# EAGLE design Black-CP2102-Zigbee-SMD-V001-not-produced (EAGLE 9.3.0)
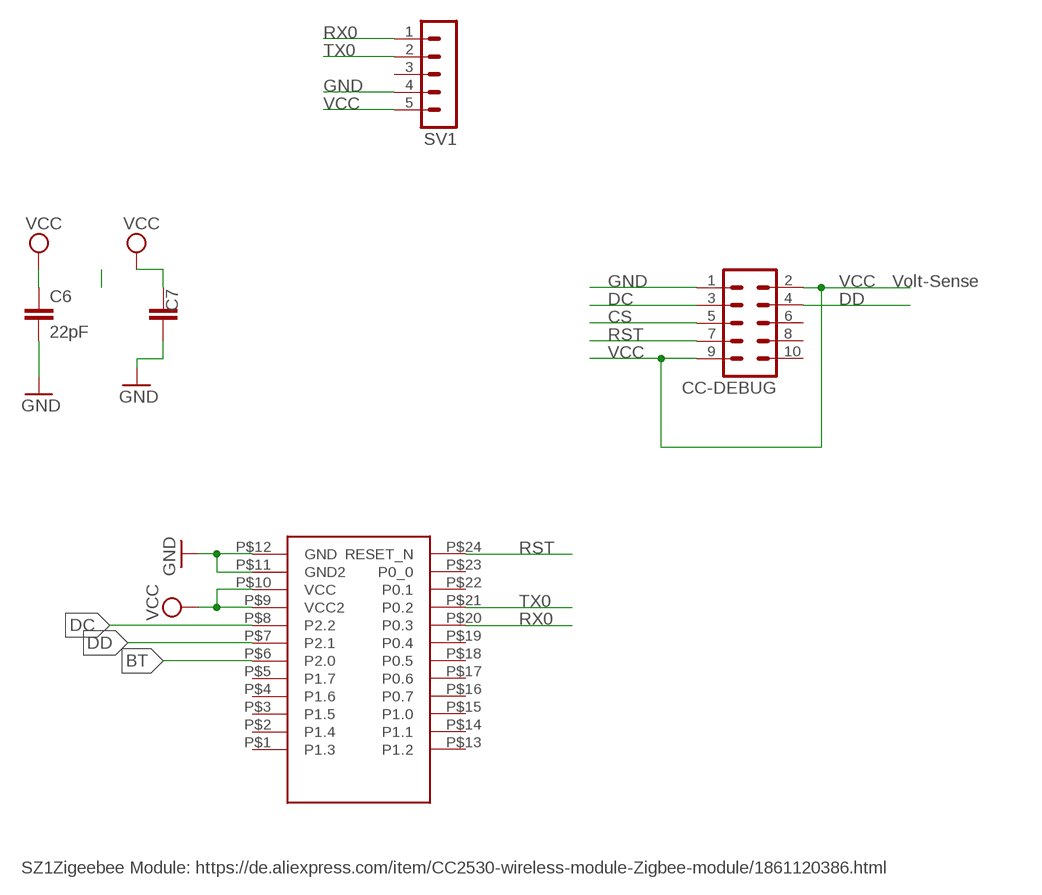
[diagram p0: schematic, sheet 1]

## Parts
C6  22pF  C-EUC0805  [C0805]
C7  C-EUC1812  [C1812]
CC-DEBUG  MA05-2  [MA05-2]
SV1  MA05-1  [MA05-1]
U$1  CC2530  [SZ1ZIGBEE-SMD]

## Nets
BT: U$1.P$6(P2.0)
CS: CC-DEBUG.5
DC: CC-DEBUG.3 U$1.P$8(P2.2)
DD: CC-DEBUG.4 U$1.P$7(P2.1)
GND [PWR]: C6.2 C7.1 CC-DEBUG.1 SV1.4 U$1.P$11(GND2) U$1.P$12(GND)
RST: CC-DEBUG.7 U$1.P$24(RESET_N)
RX0: SV1.1 U$1.P$20(P0.3)
TX0: SV1.2 U$1.P$21(P0.2)
VCC [PWR]: C6.1 C7.2 CC-DEBUG.2 CC-DEBUG.9 SV1.5 U$1.P$9(VCC2) U$1.P$10(VCC)
Unconnected: CC-DEBUG.6 CC-DEBUG.8 CC-DEBUG.10 SV1.3 U$1.P$1(P1.3) U$1.P$2(P1.4) U$1.P$3(P1.5) U$1.P$4(P1.6) U$1.P$5(P1.7) U$1.P$13(P1.2) U$1.P$14(P1.1) U$1.P$15(P1.0) U$1.P$16(P0.7) U$1.P$17(P0.6) U$1.P$18(P0.5) U$1.P$19(P0.4) U$1.P$22(P0.1) U$1.P$23(P0_0)

## Notes on the sheet
- Volt-Sense
- SZ1Zigeebee Module: https://de.aliexpress.com/item/CC2530-wireless-module-Zigbee-module/1861120386.html

## Library data of the parts
C6 C7 = rcl:C-EU: CAPACITOR, European symbol; SPICEPREFIX: C
CC-DEBUG = con-lstb:MA05-2: PIN HEADER; OC_FARNELL: unknown; OC_NEWARK: unknown
SV1 = con-lstb:MA05-1: PIN HEADER; OC_FARNELL: unknown; OC_NEWARK: unknown
U$1 = zigbee:CC2530: CC2530 Wireless Zigbee Module 3.0-3.6V 2.405-2.485GHz SMD Pads !

## Net classes
0 default: width 0.305 mm
1 PWR: width 0.61 mm

## Board
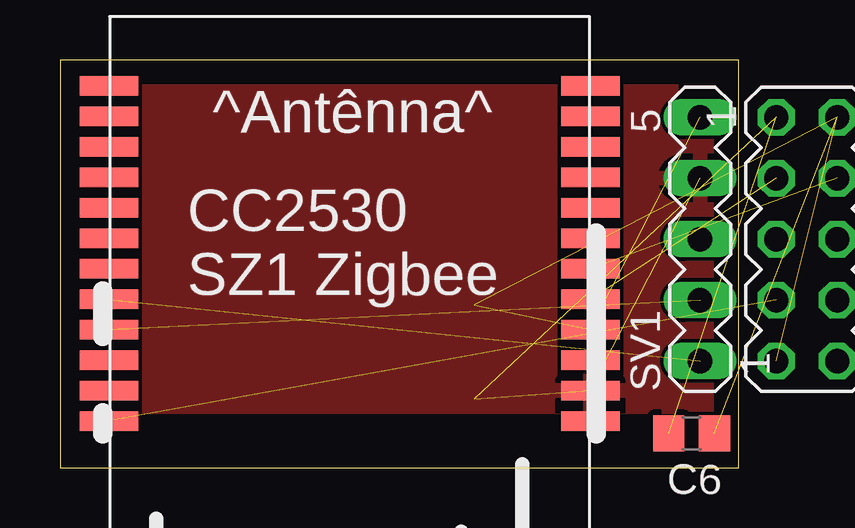
[diagram p1: board, top side]
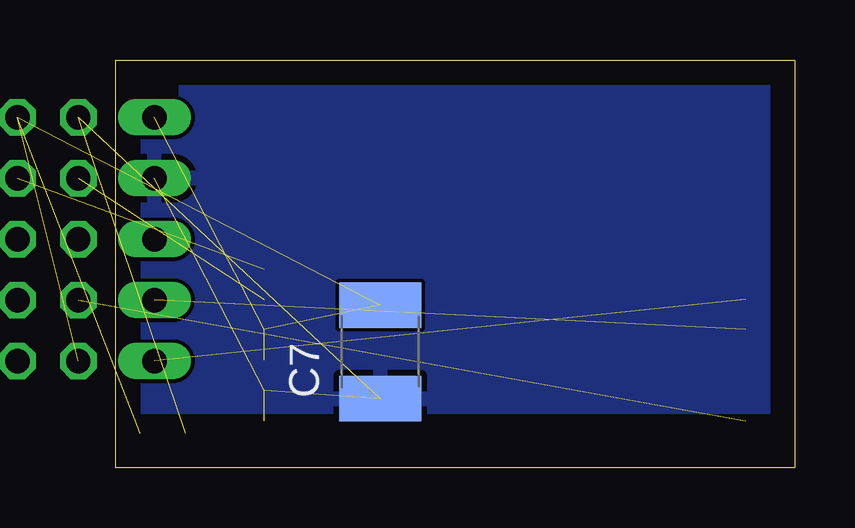
[diagram p2: board, bottom side, seen from below]

Size 28.29 x 17 mm. Coordinates in mm from the lower left corner, seen from the top.
Outline: 0,0 28.29,0 28.29,17 0,17 0,0
Copper layers (1*16): Top 0.035mm / dielectric 1.5mm / Bottom 0.035mm
Design rules "default": minimum track width 6mil, minimum drill 0.35mm, track to track 6mil, track to pad 6mil, pad to pad 6mil, via to via 6mil, smd to smd 6mil, copper to edge 40mil, drill to drill 6mil, minimum pad ring 10mil, minimum via ring 8mil, stop-mask expansion 4mil, vias tented up to drill 0mil, thermal gap 10mil

### Footprints (pad centres in the part's own frame; a part is rotated, then mirrored left to right if it is on the bottom)
C0805 = smd 1.3 x 1.5: 1 -0.95,0; 2 0.95,0
C1812 = smd 1.9 x 3.4: 1 -1.95,0; 2 1.95,0
MA05-2 = drill 1.016 octagon: 1 -5.08,-1.27; 2 -5.08,1.27; 3 -2.54,-1.27; 4 -2.54,1.27; 5 0,-1.27; 6 0,1.27; 7 2.54,-1.27; 8 2.54,1.27; 9 5.08,-1.27; 10 5.08,1.27
MA05-1 = drill 1.016 long: 1 -5.08,0; 2 -2.54,0; 3 0,0; 4 2.54,0; 5 5.08,0
SZ1ZIGBEE-SMD = smd 2.438 x 0.813: P$1 -10.036,-12.101; P$2 -10.036,-10.831; P$3 -10.036,-9.561; P$4 -10.036,-8.291; P$5 -10.036,-7.021; P$6 -10.036,-5.751; P$7 -10.036,-4.481; P$8 -10.036,-3.211; P$9 -10.036,-1.941; P$10 -10.036,-0.671; P$11 -10.036,0.599; P$12 -10.036,1.869; P$13 10.03,-12.101; P$14 10.03,-10.831; P$15 10.03,-9.561; P$16 10.03,-8.291; P$17 10.03,-7.021; P$18 10.03,-5.751; P$19 10.03,-4.481; P$20 10.03,-3.211; P$21 10.03,-1.941; P$22 10.03,-0.671; P$23 10.03,0.599; P$24 10.03,1.869

### Placement (x,y rotation side)
C6  26.32,1.43 180 top
C7  17.27,4.83 90 bottom
CC-DEBUG  31.11,9.53 270 top
SV1  26.67,9.53 90 top
U$1  12.07,3.81 180 top

### Tracks (layer width: path | path; a pad name or v marks a point on that pad's centre or on a via)
DC  (1 unrouted)
DD  (1 unrouted)
GND  (5 unrouted)
  pour Top: -5.08,15.88 27.31,15.88 27.31,2.54 -5.08,2.54
  pour Bottom: -5.08,2.54 -5.08,15.88 27.31,16.51 27.31,2.54
RST  (1 unrouted)
RX0  (1 unrouted)
TX0  (1 unrouted)
VCC  (6 unrouted)

### Text on the board
tNames: ^Antênna^